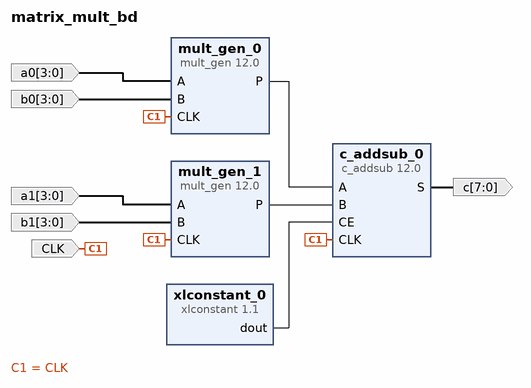
[diagram p0: block diagram of the top level]
# Vivado block design matrix_mult_bd, xc7a35tcpg236-2L, Vivado 2023.1
create_bd_design matrix_mult_bd

create_bd_port -dir I -type clk CLK
set_property -dict {CONFIG.FREQ_HZ 10000000} [get_bd_ports CLK]
create_bd_port -dir I -from 3 -to 0 -type data a0
create_bd_port -dir I -from 3 -to 0 -type data b0
create_bd_port -dir I -from 3 -to 0 -type data a1
create_bd_port -dir I -from 3 -to 0 -type data b1
create_bd_port -dir O -from 7 -to 0 -type data c

create_bd_cell -type ip -vlnv xilinx.com:ip:c_addsub:12.0 c_addsub_0
set_property -dict [list \
  CONFIG.A_Type Unsigned \
  CONFIG.A_Width 8 \
  CONFIG.B_Type Unsigned \
  CONFIG.B_Value 00000000 \
  CONFIG.B_Width 8 \
  CONFIG.Latency 1 \
  CONFIG.Out_Width 8 \
] [get_bd_cells c_addsub_0]
create_bd_cell -type ip -vlnv xilinx.com:ip:mult_gen:12.0 mult_gen_0
set_property -dict [list \
  CONFIG.PortAType Unsigned \
  CONFIG.PortAWidth 4 \
  CONFIG.PortBType Unsigned \
  CONFIG.PortBWidth 4 \
] [get_bd_cells mult_gen_0]
create_bd_cell -type ip -vlnv xilinx.com:ip:mult_gen:12.0 mult_gen_1
set_property -dict [list \
  CONFIG.PortAType Unsigned \
  CONFIG.PortAWidth 4 \
  CONFIG.PortBType Unsigned \
  CONFIG.PortBWidth 4 \
] [get_bd_cells mult_gen_1]
create_bd_cell -type ip -vlnv xilinx.com:ip:xlconstant:1.1 xlconstant_0

# ---- connections ----

connect_bd_net -net A_0_1 [get_bd_ports a0] [get_bd_pins mult_gen_0/A]
connect_bd_net -net A_1_1 [get_bd_ports a1] [get_bd_pins mult_gen_1/A]
connect_bd_net -net B_0_1 [get_bd_ports b0] [get_bd_pins mult_gen_0/B]
connect_bd_net -net B_1_1 [get_bd_ports b1] [get_bd_pins mult_gen_1/B]
connect_bd_net -net CLK_0_1 [get_bd_ports CLK] [get_bd_pins mult_gen_0/CLK] [get_bd_pins mult_gen_1/CLK] [get_bd_pins c_addsub_0/CLK]
connect_bd_net [get_bd_pins c_addsub_0/S] [get_bd_ports c]
connect_bd_net [get_bd_pins mult_gen_0/P] [get_bd_pins c_addsub_0/A]
connect_bd_net [get_bd_pins mult_gen_1/P] [get_bd_pins c_addsub_0/B]
connect_bd_net [get_bd_pins xlconstant_0/dout] [get_bd_pins c_addsub_0/CE]

validate_bd_design
save_bd_design
